# Altium schematic sheet Harvester_PB1_BOOST.SchDoc
size A4
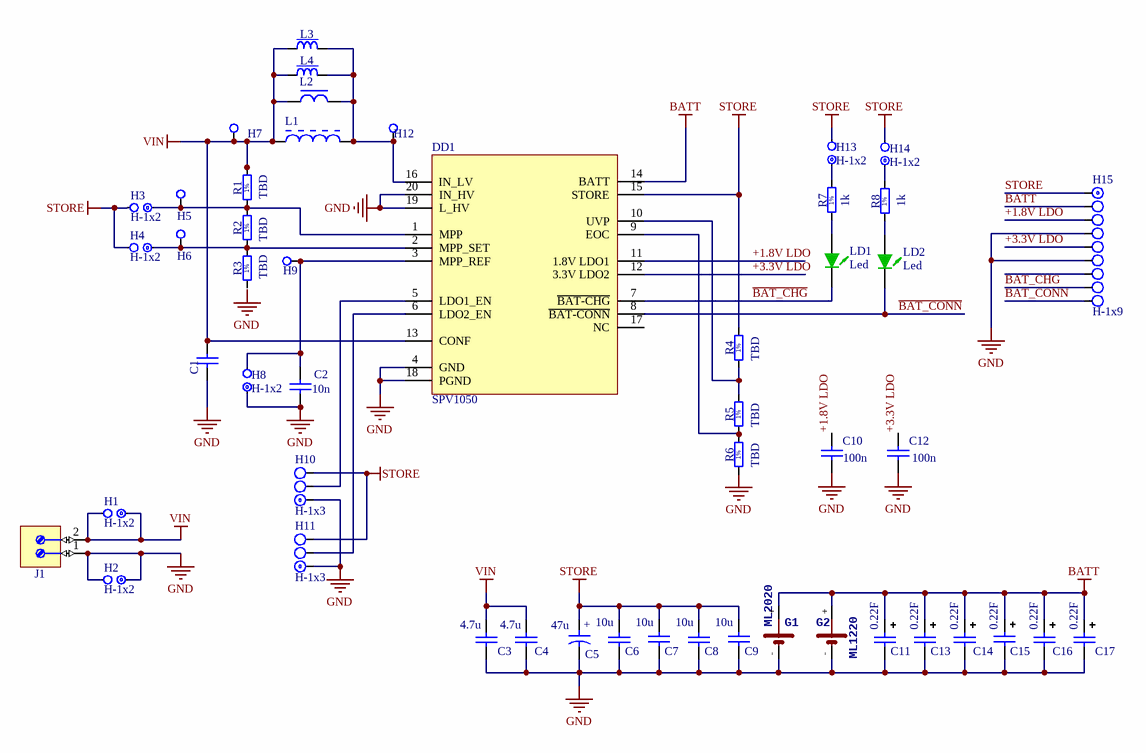
[diagram p0: Harvester_PB1_BOOST.SchDoc]

## Parts
C1  1nF  [CAPC2012X135N]  (value not drawn)
C2  10n  [CAPC2012X135N]
C3  4.7u  [CAPC0805(2012)100_N]
C4  4.7u  [CAPC0805(2012)100_N]
C5  47u  [CAPAE430X540N]
C6  10u  [CAPC0805(2012)100_N]
C7  10u  [CAPC0805(2012)100_N]
C8  10u  [CAPC0805(2012)100_N]
C9  10u  [CAPC0805(2012)100_N]
C10  100n  [CAPC2012X135N]
C11  0.22F  [EEC-S0HD224HN]
C12  100n  [CAPC2012X135N]
C13  0.22F  [EEC-S0HD224HN]
C14  0.22F  [EEC-S0HD224HN]
C15  0.22F  [EEC-S0HD224HN]
C16  0.22F  [EEC-S0HD224HN]
C17  0.22F  [EEC-S0HD224HN]
DD1  SPV1050  [QFN40P300X300X100_HS-21L]
G1  ML2020  [ML2020]
G2  ML1220  [ML1220]
H1  H-1x2  [J1x2]
H2  H-1x2  [J1x2]
H3  H-1x2  [J1x2]
H4  H-1x2  [J1x2]
H5  H-1  [J1]  (value not drawn)
H6  H-1  [J1]  (value not drawn)
H7  H-1  [J1]  (value not drawn)
H8  H-1x2  [J1x2]
H9  H-1  [J1]  (value not drawn)
H10  H-1x3  [J1x3]
H11  H-1x3  [J1x3]
H12  H-1  [J1]  (value not drawn)
H13  H-1x2  [J1x2]
H14  H-1x2  [J1x2]
H15  H-1x9  [J1x9]
J1  (no value)  [PHOENIX_1751248]
L1  BOUR-IND-2A  [BOUR-SDR0403-2_V]  (value not drawn)
L2  33u  [Dr-CW8A]  (value not drawn)
L3  22nH  [INDC2014X145N]  (value not drawn)
L4  10uH  [IND_WURTH_WE-TPC_XL]  (value not drawn)
LD1  Led  [Led 0805-Green]
LD2  Led  [Led 0805-Green]
R1  TBD  [RESC2012X60N]
R2  TBD  [RESC2012X60N]
R3  TBD  [RESC2012X60N]
R4  TBD  [RESC2012X60N]
R5  TBD  [RESC2012X60N]
R6  TBD  [RESC2012X60N]
R7  1k  [RESC2012X60N]
R8  1k  [RESC2012X60N]

## Nets
BATT: C11.+ C13.+ C14.+ C15.+ C16.+ C17.+ DD1.14(BATT) G1.+ G2.+ H15.2
GND: C1.1 C2.1 C3.1 C4.1 C5.2 C6.1 C7.1 C8.1 C9.1 C10.1 C11.- C12.1 C13.- C14.- C15.- C16.- C17.- DD1.4(GND) DD1.18(PGND) DD1.19(L_HV) DD1.20(IN_HV) G1.- G2.- H2.1 H2.2 H8.1 H10.1 H11.1 H15.4 H15.6 J1.1
STORE: C5.1 C6.2 C7.2 C8.2 C9.2 DD1.15(STORE) H3.2 H4.2 H10.3 H11.3 H13.2 H14.2 H15.1 R4.2
VIN: C1.2 C3.2 C4.2 DD1.13(CONF) H1.1 H1.2 H7.1 J1.2 L1.1 L2.1 L3.1 L4.1 R1.2
+1.8V LDO: C10.2 DD1.11(1.8V_LDO1) H15.3
+3.3V LDO: C12.2 DD1.12(3.3V_LDO2) H15.5
~{BAT_CHG}: DD1.7(~{BAT-CHG}) H15.8 LD1.2(K)
~{BAT_CONN}: DD1.8(~{BAT-CONN}) H15.9 LD2.2(K)
NetC2_2: C2.2 DD1.3(MPP_REF) H8.2 H9.1
NetDD1_1: DD1.1(MPP) H3.1 H5.1 R1.1
NetDD1_2: DD1.2(MPP_SET) H4.1 H6.1 R2.1 R3.2
NetDD1_5: DD1.5(LDO1_EN) H10.2
NetDD1_6: DD1.6(LDO2_EN) H11.2
NetDD1_9: DD1.9(EOC) R5.1 R6.2
NetDD1_10: DD1.10(UVP) R4.1 R5.2
NetDD1_16: DD1.16(IN_LV) H12.1 L1.2 L2.2 L3.2 L4.2
NetH13_1: H13.1 R7.2
NetH14_1: H14.1 R8.2
NetLD1_1: LD1.1(A) R7.1
NetLD2_1: LD2.1(A) R8.1

Not connected (* = marked no-connect by the designer): DD1 17(NC); H15 7; R2 2; R3 1; R6 1

## Notes on the sheet
- Labels drawn without touching a wire or pin: GND
- (in symbol CAE430-540_47UF_6.3V_20%) +
- (in symbol R0805_5K6_1%_0.125W_100PPM) 1%

## Library data of the parts
C1 = CC0805_1NF_50V_5%_X7R: Non-polarised capacitor; Part Description: SMD Multilayer Chip Ceramic Capacitor; Manufacturer: GENERIC; Manufacturer1 Part Number: 08055C102JAT2A; Voltage: 50V; TC: X7R; Tolerance: ±5%; Table: Capacitors SMD; Part Number: CC0805_1NF_50V_5%_X7R; Component Kind: Standard; Component Type: Standard; Pin Count: 2; Value: 1nF; Status: None; Manufacturer Part Number: CC0805_1NF_50V_5%_X7R; Case: 0805; Mounted: Yes; Socket: No; SMD: Yes; Manufacturer1 Example: AVX; Manufacturer1 ComponentHeight: 0.94mm; HelpURL: \\cern.ch\dfs\Applications\Altium\Datasheets\CC0805_X7R_AVX.pdf; Author: CERN DEM JLC; CreateDate: 18.01.2011; LatestRevisionDate: 18.01.2011
C2 C10 C12 = CC0805_1NF_50V_5%_X7R: Non-polarised capacitor; Part Description: SMD Multilayer Chip Ceramic Capacitor; Manufacturer: GENERIC; Manufacturer1 Part Number: 08055C102JAT2A; Value: 1nF; Voltage: 50V; TC: X7R; Tolerance: ±5%; Table: Capacitors SMD; Part Number: CC0805_1NF_50V_5%_X7R; Component Kind: Standard; Component Type: Standard; Pin Count: 2; Status: None; Manufacturer Part Number: CC0805_1NF_50V_5%_X7R; Case: 0805; Mounted: Yes; Socket: No; SMD: Yes; Manufacturer1 Example: AVX; Manufacturer1 ComponentHeight: 0.94mm; HelpURL: \\cern.ch\dfs\Applications\Altium\Datasheets\CC0805_X7R_AVX.pdf; Author: CERN DEM JLC; CreateDate: 18.01.2011; LatestRevisionDate: 18.01.2011
C3 C4 C6-C9 = CAP
C5 = CAE430-540_47UF_6.3V_20%: Polarised capacitor; Part Description: Aluminum Electrolytic SMT Capacitor; Manufacturer: GENERIC; Manufacturer1 Part Number: EEEFK0J470AR; Value: 47uF; Voltage: 6.3V; Tolerance: ±20%; Table: Capacitors SMD; Part Number: CAE430-540_47UF_6.3V_20%; Component Kind: Standard; Component Type: Standard; Pin Count: 2; Status: Not Recommended; Manufacturer Part Number: CAE430-540_47UF_6.3V_20%; Case: B; Mounted: Yes; Socket: No; SMD: Yes; Manufacturer1 Example: PANASONIC; Manufacturer1 ComponentHeight: 5.8mm; HelpURL: \\cern.ch\dfs\Applications\Altium\Datasheets\CAE_PANASONIC_FK.pdf; Author: CERN DEM JLC; CreateDate: 03.12.2007; LatestRevisionDate: 03.12.2007
C11 C13-C17 = CAP_Pol
DD1 = svp1050_vfqfpn: Ultralow power energy harvester and battery charger
G1 G2 = Battery Lion
J1 = PHOENIX_1751248: Terminal Block, 2 Positions, Screw Connection; Part Description: 10A 160V, Terminal Block, Pitch 3.5mm, 2 Positions, Screw Connection; Manufacturer: PHOENIX CONTACT; Manufacturer Part Number: 1751248 (MKDS 1/ 2-3,5); Part Number: PHOENIX_1751248; Component Kind: Standard; Component Type: Standard; Pin Count: 2; Mounted: Yes; Socket: No; SMD: No; Status: None; ComponentHeight: 8.5mm; HelpURL: \\cern.ch\dfs\Applications\Altium\Datasheets\PHOENIX_1751248.pdf; Author: CERN DEM JLC; CreateDate: 03.11.2009; LatestRevisionDate: 26.04.2010; Table: PHOENIX
L2 = Dr CW8A 33uH: 2A 0.07om; Price: 0.25; Value: 33u
L3 = IND0805_22NH_5%_EPCOS_B82498B: Inductor With Magnetic core; Part Description: SMT Inductor SIMID Series; Manufacturer: EPCOS; Manufacturer Part Number: B82498B3220J; Power: 600mA; Resistance: 0.09R; Tolerance: ±5%; Table: Inductors SMD; Part Number: IND0805_22NH_5%_EPCOS_B82498B; Component Kind: Standard; Component Type: Standard; Pin Count: 2; Value: 22nH; Status: Preferred; Case: 0805; Mounted: Yes; Socket: No; SMD: Yes; ComponentHeight: 1.45mm; HelpURL: \\cern.ch\dfs\Applications\Altium\Datasheets\IND0805_EPCOS_B82498B.pdf; Author: CERN DEM JLC; CreateDate: 11.02.2008; LatestRevisionDate: 26.06.2008
L4 = IND_10UH_30%_WURTH_WE-TPC_744065100: Inductor With Magnetic core; Part Description: Shielded Tiny Power Inductor (WE-TPC Serie); Manufacturer: WURTH ELEKTRONIK; Power: 3A; Resistance: 0.053R; Tolerance: ±30%; Table: Inductors SMD; Part Number: IND_10UH_30%_WURTH_WE-TPC_744065100; Component Kind: Standard; Component Type: Standard; Pin Count: 2; Value: 10uH; Status: None; Manufacturer Part Number: 744065100; Mounted: Yes; Socket: No; SMD: Yes; ComponentHeight: 3.1mm; HelpURL: \\cern.ch\dfs\Applications\Altium\Datasheets\IND_WURTH_WE-TPC_744065100.pdf; Author: CERN DEM JMW; CreateDate: 09.01.2009; LatestRevisionDate: 24.01.2012
LD1 LD2 = Led 0805 KP-2012SGC: Green 565nm 15mcd; Price: 0.09
R1-R8 = R0805_5K6_1%_0.125W_100PPM: Resistor - 1%; Part Description: General Purpose Thick Film Chip Resistor; Manufacturer: GENERIC; Manufacturer1 Part Number: NRC10F5601TRF; Value: 5k6; Power: 0.125W; TC: ±100ppm/°C; Table: Resistors SMD; Part Number: R0805_5K6_1%_0.125W_100PPM; Component Kind: Standard; Component Type: Standard; Pin Count: 2; Status: Preferred; Tolerance: ±1%; Manufacturer Part Number: R0805_5K6_1%_0.125W_100PPM; Case: 0805; Mounted: Yes; Socket: No; SMD: Yes; Manufacturer1 Example: NIC COMPONENT; Manufacturer1 ComponentHeight: 0.6mm; HelpURL: \\cern.ch\dfs\Applications\Altium\Datasheets\R0805_NIC_NRC.pdf; Author: CERN DEM JLC; CreateDate: 03.12.2007; LatestRevisionDate: 13.03.2008
H1-H4 H8 H13 H14 = H-1x2: Price: 0.02
H5-H7 H9 H12 = H-1: Price: 0.01
H10 H11 = H-1x3: Price: 0.03
H15 = H-1x9: Price: 0.09